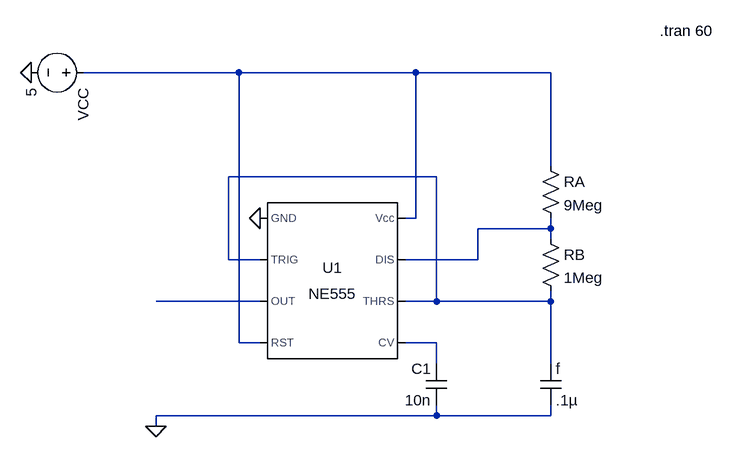
[diagram p0: schematic astableclock2.asc]
astableclock2.asc, the LTspice schematic file:
Version 4
SHEET 1 988 680
WIRE 240 -160 0 -160
WIRE 512 -160 240 -160
WIRE 720 -160 512 -160
WIRE 720 -16 720 -160
WIRE 544 0 224 0
WIRE 512 64 512 -160
WIRE 512 64 496 64
WIRE 720 80 720 64
WIRE 720 80 608 80
WIRE 720 96 720 80
WIRE 224 128 224 0
WIRE 272 128 224 128
WIRE 608 128 608 80
WIRE 608 128 496 128
WIRE 272 192 112 192
WIRE 544 192 544 0
WIRE 544 192 496 192
WIRE 720 192 720 176
WIRE 720 192 544 192
WIRE 240 256 240 -160
WIRE 272 256 240 256
WIRE 544 256 496 256
WIRE 544 288 544 256
WIRE 720 288 720 192
WIRE 544 368 544 352
WIRE 544 368 112 368
WIRE 720 368 720 352
WIRE 720 368 544 368
WIRE 112 384 112 368
FLAG 272 64 0
FLAG -80 -160 0
FLAG 112 384 0
SYMBOL voltage 16 -160 R90
WINDOW 123 0 0 Left 2
WINDOW 39 0 0 Left 2
SYMATTR InstName VCC
SYMATTR Value 5
SYMBOL Misc\\NE555 384 160 R0
SYMATTR InstName U1
SYMBOL cap 560 352 R180
WINDOW 0 24 56 Left 2
WINDOW 3 24 8 Left 2
SYMATTR InstName C1
SYMATTR Value 10n
SYMBOL res 704 80 R0
SYMATTR InstName RB
SYMATTR Value 1Meg
SYMBOL cap 704 288 R0
SYMATTR InstName f
SYMATTR Value .1µ
SYMBOL res 704 -32 R0
SYMATTR InstName RA
SYMATTR Value 9Meg
TEXT 888 -224 Left 2 !.tran 60

The netlist it stands for:
* astableclock2.asc
VCC N001 0 5
XU1 0 N002 N004 N001 N005 N002 N003 N001 NE555  ; pins GND TRIG OUT RST CV THRS DIS Vcc
C1 0 N005 10n
RB N003 N002 1Meg
C§f N002 0 .1µ
RA N001 N003 9Meg
.tran 60
.lib NE555.sub
.backanno
.end